# Altium schematic sheet power.SchDoc
size A4
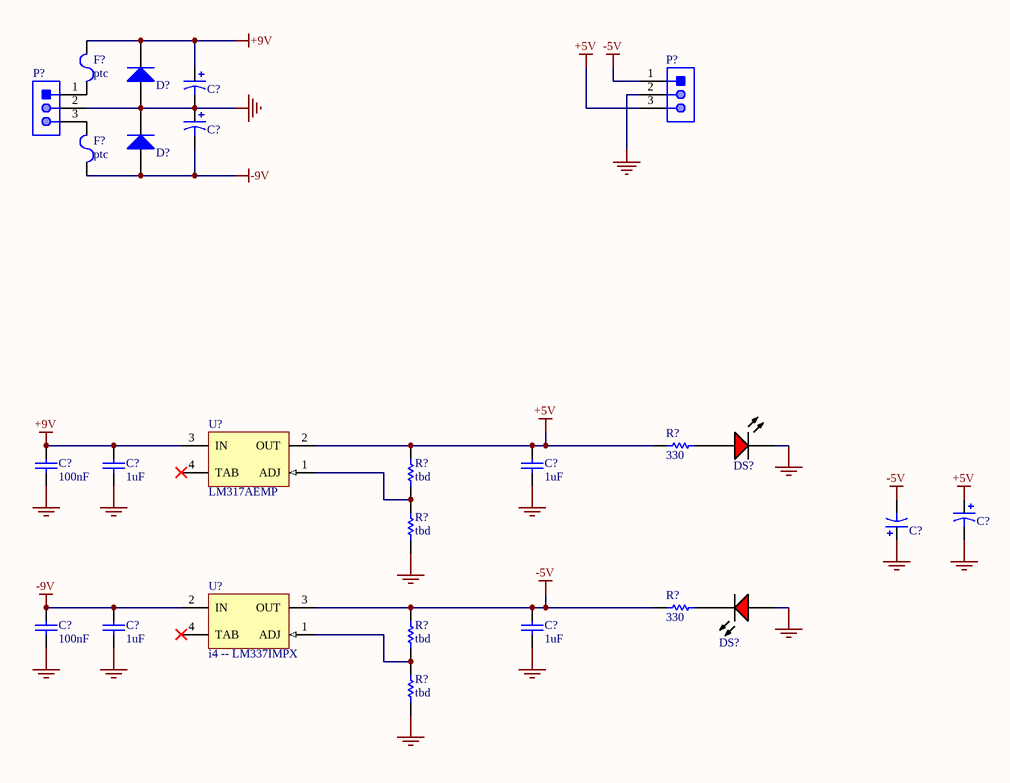
[diagram p0: power.SchDoc]

## Parts
(Parts that share a designator on the sheet are numbered #1, #2 ... from top to bottom, then left to right.)
C?#1  ECA-1HM470  [PNSC-ECA-1HM470]  (value not drawn)
C?#2  ECA-1HM470  [PNSC-ECA-1HM470]  (value not drawn)
C?#3  100nF  [CAPC0603(1608)100_N]
C?#4  1uF  [CAPC0603(1608)100_N]
C?#5  1uF  [CAPC0603(1608)100_N]
C?#6  ECA-1HM470  [PNSC-ECA-1HM470]  (value not drawn)
C?#7  ECA-1HM470  [PNSC-ECA-1HM470]  (value not drawn)
C?#8  100nF  [CAPC0603(1608)100_N]
C?#9  1uF  [CAPC0603(1608)100_N]
C?#10  1uF  [CAPC0603(1608)100_N]
D?#1  MMSD4148T3G  [ONSC-SOD123-2-425G-04_V]  (value not drawn)
D?#2  MMSD4148T3G  [ONSC-SOD123-2-425G-04_V]  (value not drawn)
DS?#1  TLMS1100-GS08  [VISH-TLMX1100_V]  (value not drawn)
DS?#2  TLMS1100-GS08  [VISH-TLMX1100_V]  (value not drawn)
F?#1  ptc  [LFUS-1206L012WR_V]
F?#2  ptc  [LFUS-1206L012WR_V]
P?#1  22-27-2031  [MOLX-22-27-2031_V]  (value not drawn)
P?#2  22-27-2031  [MOLX-22-27-2031_V]  (value not drawn)
R?#1  330  [RESC0603(1608)_N]
R?#2  tbd  [RESC0603(1608)_N]
R?#3  tbd  [RESC0603(1608)_N]
R?#4  330  [RESC0603(1608)_N]
R?#5  tbd  [RESC0603(1608)_N]
R?#6  tbd  [RESC0603(1608)_N]
U?#1  LM317AEMP  [DCY0004A_N]
U?#2  i4 -- LM337IMPX  [MP04A_N]

## Nets
+5V: C?#5.2 C?#6.1(+) P?#1.3 R?#1.1 R?#2.1 U?#1.2(OUT)
+9V: C?#1.1(+) C?#3.2 C?#4.2 D?#1.1(CATHODE) F?#1.2 U?#1.3(IN)
-5V: C?#7.2(-) C?#10.2 P?#1.1 R?#4.1 R?#5.1 U?#2.3(OUT)
-9V: C?#2.2(-) C?#8.2 C?#9.2 D?#2.2(ANODE) F?#2.1 U?#2.2(IN)
GND: C?#1.2(-) C?#2.1(+) C?#3.1 C?#4.1 C?#5.1 C?#6.2(-) C?#7.1(+) C?#8.1 C?#9.1 C?#10.1 D?#1.2(ANODE) D?#2.1(CATHODE) DS?#1.2(K) DS?#2.1(A) P?#1.2 P?#2.2 R?#3.2 R?#6.2
NetDS?#1_1: DS?#1.1(A) R?#1.2
NetDS?#2_2: DS?#2.2(K) R?#4.2
NetF?#1_1: F?#1.1 P?#2.1
NetF?#2_2: F?#2.2 P?#2.3
NetR?#2_2: R?#2.2 R?#3.1 U?#1.1(ADJ)
NetR?#5_2: R?#5.2 R?#6.1 U?#2.1(ADJ)

Not connected (* = marked no-connect by the designer): U?#1 4(TAB)*; U?#2 4(TAB)*

## Library data of the parts
C?#1 C?#2 C?#6 C?#7 = CMP-1665-00013-1: CAP ALUM 47UF 50V 20% RADIAL; PartNumber: ECA-1HM470; PackageReference: ECA-1HM470; ComponentLink1Description: Datasheet; ComponentLink1URL: http://industrial.panasonic.com/cdbs/www-data/pdf/RDF0000/ABA0000C1047.pdf
C?#3 C?#8 = CMP-1035-02589-1: CAP 100nF 25V ±20% 0603 (1608 Metric) Thickness 1mm SMD; Case-EIA: 0603; Tolerance: Â±20%; Case-Metric: 1608; Value: 100nF; Max Thickness: 1 mm; Technology: SMT; Rated Voltage: 25 V
C?#4 C?#5 C?#9 C?#10 = CMP-1035-02589-1: CAP 1uF 25V ±20% 0603 (1608 Metric) Thickness 1mm SMD; Value: 100nF; Case-EIA: 0603; Tolerance: Â±20%; Case-Metric: 1608; Max Thickness: 1 mm; Technology: SMT; Rated Voltage: 25 V
D?#1 D?#2 = CMP-0895-00002-1: Switching Diode, 100 V, 200 mA, -55 to 150 degC, 2-Pin SOD123 (425), RoHS, Tape and Reel; Manufacturer: ON Semiconductor; CD (Max): 4 pF; IR @ VR: 75 V (Max)=50 uA; PD (Max): 425 mW; VF (Max): 1 A; Trr (Max): 4 ns; VBR (Min): 100 V; ComponentLink1URL: http://www.onsemi.com/; ComponentLink1Description: Manufacturer URL; PackageReference: SOD123-2-425G-04; PackageDescription: 2-Pin SOD123, Body 2.69 x 1.6 mm, Height 1.35 mm; ComponentLink2Description: Datasheet; Mounting Technology: Surface Mount; RoHS: TRUE; PartNumber: MMSD4148T3G; PackageVersion: Rev. 04G; DatasheetVersion: Rev. 11; Temperature Range: -55 to 150 degC; ComponentLink3Description: Package Specification; Packing: Tape and Reel; ComponentLink3URL: http://www.onsemi.com/pub_link/Collateral/425-04.PDF; ComponentLink2URL: http://www.onsemi.com/pub_link/Collateral/MMSD4148T1-D.PDF
DS?#1 DS?#2 = CMP-1666-00027-1: LED, RED, 2.1 V, -40 to 100 degC, 2-Pin SMD (0603), RoHS, Tape and Reel; Type (Capacitors): C0G; Resistance: 100000000000 Ohm; Capacitance: 12 pF; Voltage Rating: 50 V; Tolerance: 5%; Min Operating Temperature: -55degC; REACH SVHC: No SVHC; ComponentLink2Description: Datasheet; ComponentLink1URL: http://www.vishay.com/; Width: 0.8 mm; Package Quantity: 4000; PackageReference: TLMX1100; ComponentLink2URL: http://www.vishay.com/docs/83173/tlmb1100.pdf; Case/Package: 0603; Case Code (Metric): 1608; Packaging: Tape and Reel; Pins: 2; ComponentLink1Description: Manufacturer URL; Max Operating Temperature: 125degC; Height: 0.8 mm; Length: 1.6 mm; Mount: Surface Mount; PackageDescription: 2-Pin Surface Mount Device, Body 1.6 x 0.8 mm; DatasheetVersion: Rev. 2.7, 03/2016; Case Code (Imperial): 0603; Voltage Rating (DC): 50 V; RoHSCompliant: True; Radiation Hardening: No
F?#1 F?#2 = CMP-2000-05470-1: 200mA PTC; Manufacturer: Littelfuse; Hold Current [Ih]: 0.125A; Working Voltage-Max: 30V; Trip Current: 0.29A; Operating Temp Range: -40to+85°C; Package Reference: 1206; Package Description: 2-Pin Surface Mount Device, Body 3.2 x 1.65 mm; Mounting Technology: SurfaceMount; Manufacturer URL: http://www.littelfuse.com/; Datasheet URL: https://datasheet.ciiva.com/26787/1206l012wr-26787215.pdf; Size: 1206; Datasheet Version: 04/2012
P?#1 P?#2 = CMP-2000-05538-1: Male Header, Pitch 2.54 mm, 1 x 3 Position, Height 11.7 mm, Tail Length 3.56 mm, -40 to 80 degC, RoHS, Bulk; Manufacturer: Molex; Voltage rating: 250V; Current rating: 4A; Package Reference: 22-27-2031; Housing material: Nylon(UL94V-0); Operating temperature: 0°Cto+75°C; Package Description: Male Header, Pitch 2.54 mm, 1 x 3 Position, Height 11.7 mm, Tail Length 3.56 mm; Package URL: http://www.molex.com/pdm_docs/sd/022272031_sd.pdf; Datasheet Version: 06/2016; Manufacturer URL: http://www.molex.com/; Mounting Technology: ThroughHole; Datasheet URL: http://www.molex.com/webdocs/datasheets/pdf/en-us/0022272031_PCB_HEADERS.pdf; Contact material: Tinplatedbrass
R?#1-R?#6 = CMP-1012-00397-1: 100R 0.1W 1% 0603 (1608 Metric)  SMD; Value: 100.00 Ohm; Case-EIA: 0603; Case-Metric: 1608; Technology: SMT; Tolerance: 1 %; Power: 0.1 W
U?#1 = CMP-0062-01709-3: 3-Terminal Adjustable Regulator, 4-pin SOT-223; Manufacturer: Texas Instruments; PowerWise: N; CompType: LDO IC; PackageTopMarking: XYTT*N07A; Code_JEDEC: TO-261-AA; PackageReference: DCY0004A; ComponentLink1URL: http://www.ti.com/general/docs/lit/getliterature.tsp?genericPartNumber=LM317-N&fileType=pdf; Code_IPC: SOT223-4; PinCount: 4; ComponentLink1Description: Datasheet URL; PackageDescription: Molded SOT-223, 6.50 x 3.56 x 1.6mm Body, 4 Lead, 2.3mm Pitch; RoHS: N
U?#2 = CMP-0062-01833-1: 3-Terminal Adjustable Negative Regulator, 4-pin SOT-223; Manufacturer: National Semiconductor; PackageTopMarking: XYTT*N02A; PowerWise: N; CompType: LDO IC; PinCount: 4; PackageDescription: Molded SOT-223, 6.50 x 3.56 x 1.6mm Body, 4 Lead, 2.3mm Pitch; DatasheetVersion: Nov-2004; Code_JEDEC: TO-261-AA; PackageVersion: revB, Apr-2003; PackageReference: MP04A; Code_IPC: SOT223-4; RoHS: N